# Altium project STM32F072RB_BaseBoard.PrjPcb
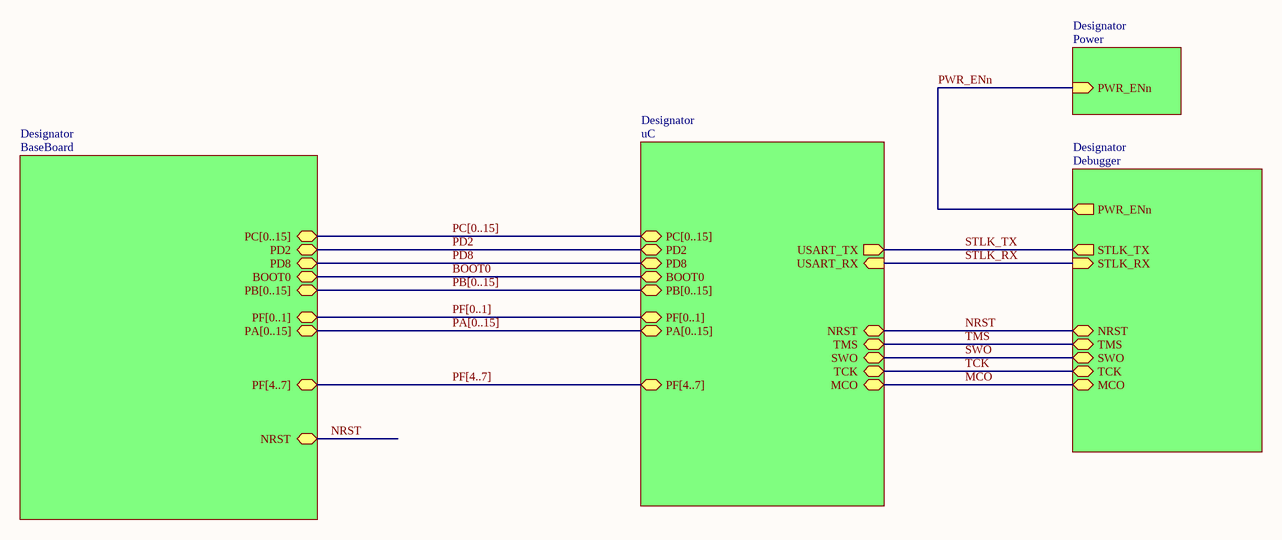
[diagram p0: TOP.SchDoc]
5 sheets, 112 parts. Net scope: hierarchical (ports join the sheet entries above them; power ports are global).
Sheets:
  TOP.SchDoc
    Designator = Debugger.SchDoc
    Designator = uC.SchDoc
    Designator = BaseBoard.SchDoc
    Designator = Power.SchDoc

## Sheet TOP.SchDoc
size A4; DocumentNumber: 1; SheetNumber: 1

### Sub-sheets
Designator = Debugger: MCO, STLK_TX (out), STLK_RX (in), NRST, TMS, SWO, TCK, PWR_ENn (out)
Designator = uC: PC[0..15] (bidir), NRST, PD2, PD8, BOOT0, PB[0..15] (bidir), USART_RX (in), PF[0..1] (bidir), PA[0..15] (bidir), USART_TX (out), TCK, TMS, PF[4..7] (bidir), SWO, MCO
Designator = BaseBoard: PD8, BOOT0, PC[0..15] (bidir), PB[0..15] (bidir), NRST, PF[0..1] (bidir), PF[4..7] (bidir), PD2, PA[0..15] (bidir)
Designator = Power: PWR_ENn (in)

### Nets
STLK_RX: sheet Designator/STLK_RX, sheet Designator/USART_RX  [project net PA3]
BOOT0: sheet Designator/BOOT0, sheet Designator/BOOT0
MCO: sheet Designator/MCO, sheet Designator/MCO
NRST: sheet Designator/NRST, sheet Designator/NRST, sheet Designator/NRST
PD2: sheet Designator/PD2, sheet Designator/PD2
PD8: sheet Designator/PD8, sheet Designator/PD8
PWR_ENn: sheet Designator/PWR_ENn, sheet Designator/PWR_ENn
STLK_TX: sheet Designator/STLK_TX, sheet Designator/USART_TX  [project net PA2]
SWO: sheet Designator/SWO, sheet Designator/SWO  [project net PB3]
TCK: sheet Designator/TCK, sheet Designator/TCK  [project net PA14]
TMS: sheet Designator/TMS, sheet Designator/TMS  [project net PA13]

### Buses and harness runs
bus PA[0..15] = sheet Designator/PA[0..15]
bus PB[0..15] = sheet Designator/PB[0..15]
bus PC[0..15] = sheet Designator/PC[0..15]
bus PF[0..1] = sheet Designator/PF[0..1]
bus PF[4..7] = sheet Designator/PF[4..7]

## Sheet Debugger.SchDoc
size A3; DocumentNumber: 2; SheetNumber: 2
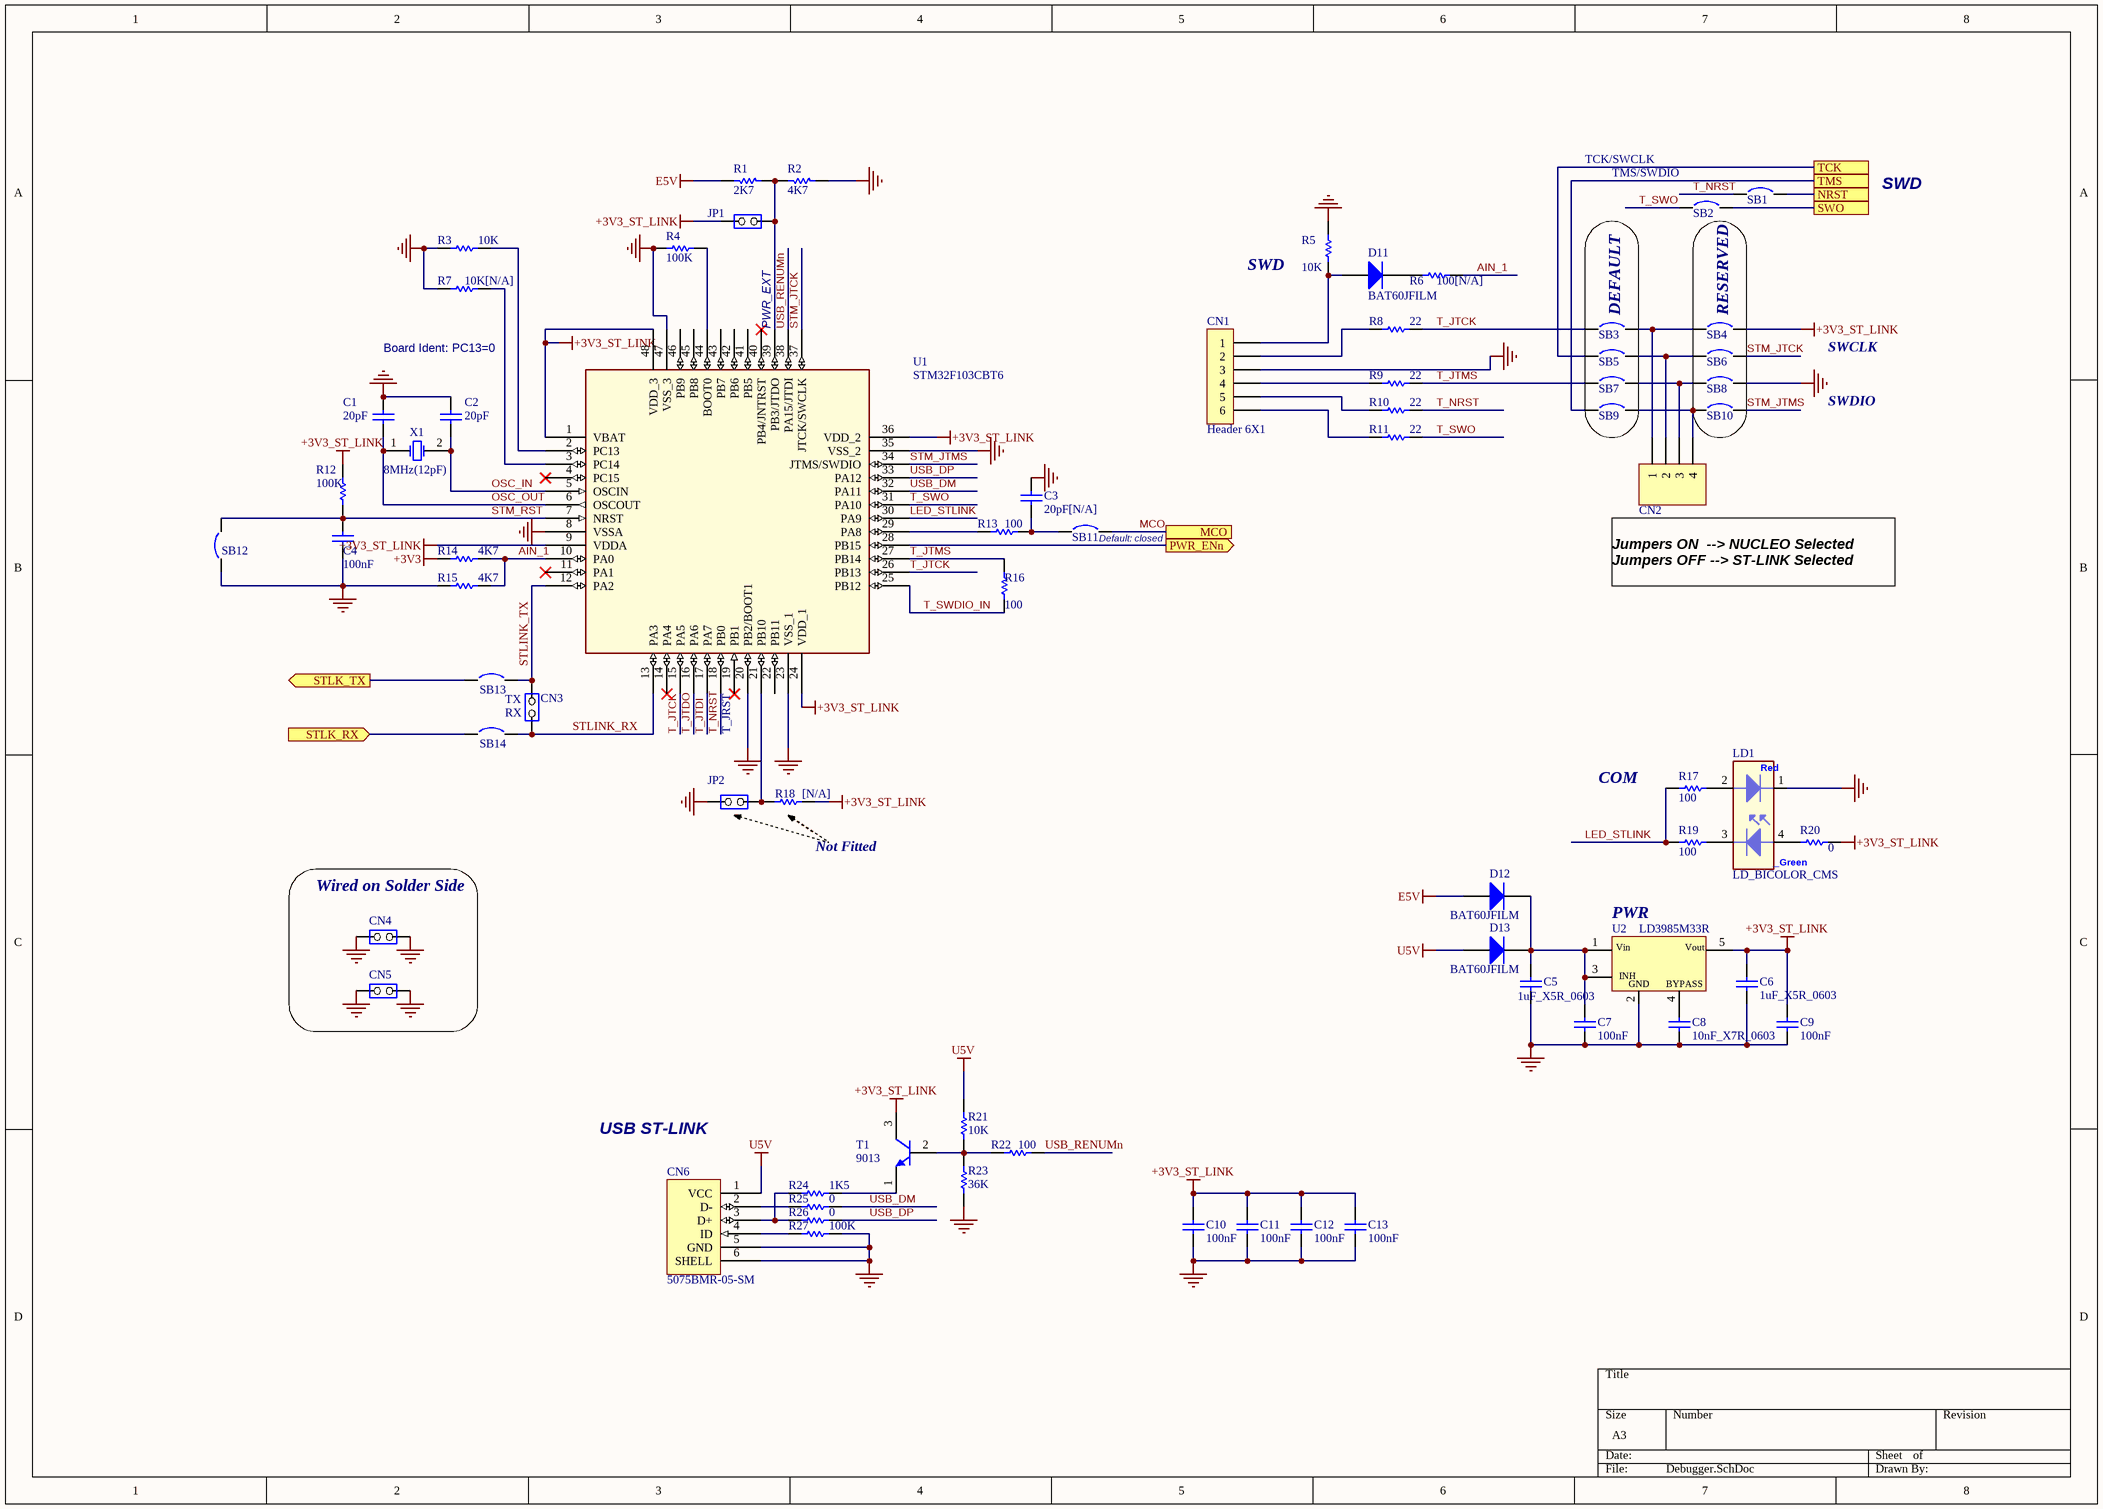
[diagram p1: Debugger.SchDoc]

### Parts
C1  20pF  [0603C]
C2  20pF  [0603C]
C3  20pF[N/A]  [0603C]
C4  100nF  [0603C]
C5  1uF_X5R_0603  [0603C]
C6  1uF_X5R_0603  [0603C]
C7  100nF  [0603C]
C8  10nF_X7R_0603  [0603C]
C9  100nF  [0603C]
C10  100nF  [0603C]
C11  100nF  [0603C]
C12  100nF  [0603C]
C13  100nF  [0603C]
CN1  Header 6X1  [1*6P]
CN2  Header 4  [1*4]  (value not drawn)
CN3  (no value)  [SIP2/2.54]
CN4  (no value)  [SIP2/2.54]
CN5  (no value)  [SIP2/2.54]
CN6  5075BMR-05-SM  [USB-MINI-B-SMD]
D11  BAT60JFILM  [SOD323/A]
D12  BAT60JFILM  [SOD323/A]
D13  BAT60JFILM  [SOD323/A]
JP1  (no value)  [SIP2/2.54]
JP2  (no value)  [SIP2/2.54]
LD1  LD_BICOLOR_CMS  [HSMF-A201]
R1  2K7  [0603R]
R2  4K7  [0603R]
R3  10K  [0603R]
R4  100K  [0603R]
R5  10K  [0603R]
R6  100[N/A]  [0603R]
R7  10K[N/A]  [0603R]
R8  22  [0603R]
R9  22  [0603R]
R10  22  [0603R]
R11  22  [0603R]
R12  100K  [0603R]
R13  100  [0603R]
R14  4K7  [0603R]
R15  4K7  [0603R]
R16  100  [0603R]
R17  100  [0603R]
R18  [N/A]  [0603R]
R19  100  [0603R]
R20  0  [0603R]
R21  10K  [0603R]
R22  100  [0603R]
R23  36K  [0603R]
R24  1K5  [0603R]
R25  0  [0603R]
R26  0  [0603R]
R27  100K  [0603R]
SB1  Circuit Breaker  [JP2_SMD]  (value not drawn)
SB2  Circuit Breaker  [JP2_SMD]  (value not drawn)
SB3  Circuit Breaker  [JP2_SMD]  (value not drawn)
SB4  Circuit Breaker  [JP2_SMD]  (value not drawn)
SB5  Circuit Breaker  [JP2_SMD]  (value not drawn)
SB6  Circuit Breaker  [JP2_SMD]  (value not drawn)
SB7  Circuit Breaker  [JP2_SMD]  (value not drawn)
SB8  Circuit Breaker  [JP2_SMD]  (value not drawn)
SB9  Circuit Breaker  [JP2_SMD]  (value not drawn)
SB10  Circuit Breaker  [JP2_SMD]  (value not drawn)
SB11  Circuit Breaker  [JP2_SMD]  (value not drawn)
SB12  Circuit Breaker  [JP2_SMD]  (value not drawn)
SB13  Circuit Breaker  [JP2_SMD]  (value not drawn)
SB14  Circuit Breaker  [JP2_SMD]  (value not drawn)
T1  9013  [SOT-23]
U1  STM32F103CBT6  [QFP48 7X7]
U2  LD3985M33R  [SOT-23-5L]
X1  8MHz(12pF)  [XTAL1]

### Blocks framed on the sheet
DEFAULT: SB3 SB5 SB7 SB9
RESERVED: SB4 SB6 SB8 SB10
Wired on Solder Side: CN4 CN5

### Ports
MCO, NRST, PWR_ENn (out), STLK_RX (in), STLK_TX (out), SWO, TCK, TMS

### Nets
+3V3: R14.1
+3V3_ST_LINK: C6.1 C9.2 C10.2 C11.2 C12.2 C13.2 JP1.1(COMMON) R12.2 R18.1 R20.2 SB4.2 T1.3(C) U1.1(VBAT) U1.9(VDDA) U1.24(VDD_1) U1.36(VDD_2) U1.48(VDD_3) U2.5(Vout)
E5V: D12.1(A) R1.1
GND: C1.2 C2.2 C3.2 C4.1 C5.1 C6.2 C7.1 C8.1 C9.1 C10.1 C11.1 C12.1 C13.1 CN1.3 CN4.1(COMMON) CN4.2(NO) CN5.1(COMMON) CN5.2(NO) CN6.5(GND) CN6.6(SHELL) JP2.1(COMMON) LD1.1 R2.2 R3.1 R4.1 R5.2 R7.1 R15.1 R23.1 R27.2 SB8.2 SB12.1 U1.8(VSSA) U1.20(PB2/BOOT1) U1.23(VSS_1) U1.35(VSS_2) U1.47(VSS_3) U2.2(GND)
PA3: SB14.1 ; port STLK_RX
U5V: CN6.1(VCC) D13.1(A) R21.2
AIN_1: R6.2 R14.2 R15.2 U1.10(PA0)
LED_STLINK: R17.1 R19.1 U1.30(PA9)
MCO: SB11.2 ; port MCO
NRST: SB1.2 ; port NRST
OSC_IN: C2.1 U1.5(OSCIN) X1.2(OSC2)
OSC_OUT: C1.1 U1.6(OSCOUT) X1.1(OSC1)
PA2: SB13.1 ; port STLK_TX
PA13: SB9.1 ; port TMS
PA14: SB5.1 ; port TCK
PB3: SB2.2 ; port SWO
PWR_ENn: U1.28(PB15) ; port PWR_ENn
STLINK_RX: CN3.1(COMMON) SB14.2 U1.13(PA3)
STLINK_TX: CN3.2(NO) SB13.2 U1.12(PA2)
STM_JTCK: SB6.2 U1.37(JTCK/SWCLK)
STM_JTMS: SB10.2 U1.34(JTMS/SWDIO)
STM_RST: C4.2 R12.1 SB12.2 U1.7(NRST)
T_JTCK: R8.2 SB3.1 U1.15(PA5) U1.26(PB13)
T_JTDI: U1.17(PA7)
T_JTDO: U1.16(PA6)
T_JTMS: R9.2 R16.2 SB7.1 U1.27(PB14)
T_NRST: R10.2 SB1.1 U1.18(PB0)
T_SWDIO_IN: R16.1 U1.25(PB12)
T_SWO: R11.2 SB2.1 U1.31(PA10)
USB_DM: R25.2 U1.32(PA11)
USB_DP: R26.2 U1.33(PA12)
USB_RENUMn: R22.2 U1.38(PA15/JTDI)
NetC3_1: C3.1 R13.2 SB11.1
NetC5_2: C5.2 C7.2 D12.2(K) D13.2(K) U2.1(Vin) U2.3(CE)
NetC8_2: C8.2 U2.4(BYPASS)
NetCN1_1: CN1.1 D11.1(A) R5.1
NetCN1_2: CN1.2 R8.1
NetCN1_4: CN1.4 R9.1
NetCN1_5: CN1.5 R10.1
NetCN1_6: CN1.6 R11.1
NetCN2_1: CN2.1 SB3.2 SB4.1
NetCN2_2: CN2.2 SB5.2 SB6.1
NetCN2_3: CN2.3 SB7.2 SB8.1
NetCN2_4: CN2.4 SB9.2 SB10.1
NetCN6_2: CN6.2(D-) R25.1
NetCN6_3: CN6.3(D+) R24.1 R26.1
NetCN6_4: CN6.4(ID) R27.1
NetD11_2: D11.2(K) R6.1
NetJP1_2: JP1.2(NO) R1.2 R2.1 U1.39(PB3/JTDO)
NetJP2_2: JP2.2(NO) R18.2 U1.21(PB10)
NetLD1_2: LD1.2 R17.2
NetLD1_3: LD1.3 R19.2
NetLD1_4: LD1.4 R20.1
NetR3_2: R3.2 U1.2(PC13)
NetR4_2: R4.2 U1.44(BOOT0)
NetR7_2: R7.2 U1.3(PC14)
NetR13_1: R13.1 U1.29(PA8)
NetR21_1: R21.1 R22.1 R23.2 T1.2(B)
NetR24_2: R24.2 T1.1(E)

Not connected (* = marked no-connect by the designer): U1 4(PC15)* 11(PA1)* 14(PA4)* 19(PB1)* 22(PB11) 40(PB4/JNTRST)* 41(PB5) 42(PB6) 43(PB7) 45(PB8) 46(PB9)

### Notes on the sheet
- TCK/SWCLK
- (near SB2) TMS/SWDIO
- SWD
- Board Ident: PC13=0
- (near U1) PWR_EXT
- SWCLK
- SWDIO
- (near SB11) Default: closed
- Jumpers ON  --> NUCLEO Selected
  Jumpers OFF --> ST-LINK Selected
- TX
- RX
- T_JRST
- COM
- (near R18) Not Fitted
- (near U2) PWR
- USB ST-LINK
- (in symbol LD3985M33R) INH
- (in symbol LD_BICOLOR_CMS) Red; _Green

### Library data of the parts
C1-C3 = Capacitor_ST: Capacitor 0402 / 0603 / 0805; Value: 100nF; Revision: July-2002: Re-released for DXP Platform.
C4 C7 C9-C13 = Capacitor_ST: Capacitor 0402 / 0603 / 0805; Revision: July-2002: Re-released for DXP Platform.; Value: 100nF
C5 C6 = CAP SMD 0603  X5R 1µF 25V 10%: 0603  X5R 1µF; Rated voltage: 25V; Tolerance: 10%; Manufacturer: *; Manufacturer P/N: *; Order code Farnell: 1288202RL; Value: 1µF; Power: *; Technology: X5R; Temperature  Factor: *; Temperature Max: +125°C; Temperature Min: -55°C; STS Code: *
C8 = CAP SMD 0603  X7R 10000PF 50V 10%: 0603  X7R 10NF; Order code RS: 2040779; Rated voltage: 50V; Tolerance: 10%; Order code Farnell: 7569548RL; Value: 10NF; Power: *; Technology: X7R; Temperature Factor: *; Temperature Min: -55°C; Temperature Max: +125°C; STS Code: *
CN1 = Header 6X1: Header, 6-Pin, Single row; LatestRevisionDate: 17-Jul-2002; LatestRevisionNote: Re-released for DXP Platform.; Publisher: Altium Limited
CN2 = Header 4: Header, 4-Pin, Single row; Revision: 17-Jul-2002: Re-released for DXP Platform.; Publisher: Altium Limited
CN3 = JP2: Fitted: NO
CN4 CN5 JP1 JP2 = JP2
CN6 = USB-MINI-typeB connector: Manuf_Part_1: 5075BMR-05-SM; Order: 5075BMR-05-SM; ECCN: ????
D11-D13 = BAT60JFILM: Manuf_1: STM; Provided: ST; ECCN_US/EU: EAR99/NEC; Revision: July-2002: Re-released for DXP Platform.; Order: BAT60JFILM; Manuf_Part_1: BAT60JFILM; Distrib: ST
LD1 = LD_BICOLOR_CMS: Bicolor Led; Manuf_Part_1: HSMF-A201-A00J1; Manuf_1: Avago Technologies; Ref St: xxxxxx; cap_dec: ----; Distrib: RADIOSPARES
R1 R2 R18 R21 R23 = Res1: Resistor; Value: 1K; Published: 8-Jun-2000; Revision: July-2002: Re-released for DXP Platform.; Publisher: Altium Limited
R3 R5 = Resistor_ST: Resistor 0402 / 0603 / 0805; Value: 10K
R4 R6 R8-R13 R16 R17 R19 R20 R22 R24-R27 = Resistor_ST: Resistor 0402 / 0603 / 0805; Value: 10K
R7 R14 R15 = Resistor_ST: Resistor 0402 / 0603 / 0805; Value: 10K; Fitted: NO
SB1 SB4 SB6 SB8 SB10 = Circuit Breaker: Solder: YES; Published: 24-Mar-1999; Revision: July-2002: Re-released for DXP Platform.; Publisher: Altium Limited
SB2 SB3 SB5 SB7 SB9 SB11-SB14 = Circuit Breaker: Solder: NO; Published: 24-Mar-1999; Revision: July-2002: Re-released for DXP Platform.; Publisher: Altium Limited
T1 = NPN: NPN Bipolar Transistor; Code - JEDEC: TO-226-AA; Published: 8-Jun-2000; Revision: July-2002: Re-released for DXP Platform.; Publisher: Altium Limited
U1 = STM32F103CBT6: Medium-density performance line ARM-based 32-bit MCU with 64KB Flash; Manuf_Part_1: STM32F103C8T6; Manuf_1: STM; Ref St: 9175981; Provided: ST; ECCN_US/EU: 3A991A2/NEC; Distrib: ST; Order: STM32F103C8T6
U2 = LD3985M33R: Ultra low drop-low noise BiCMOS voltage, regulators low ESR capacitors compatible; Manuf_1: STM; Provided: ST; Ref St: 9176161; ECCN_US/EU: EAR99/NEC; Manuf_Part_1: LD3985M33R; Distrib: ST; Order: LD3985M33R
X1 = XTAL: Crystal Oscillator; Published: 8-Jun-2000; LatestRevisionDate: 17-Jul-2002; LatestRevisionNote: Re-released for DXP Platform.; PackageReference: R38; Publisher: Altium Limited

## Sheet uC.SchDoc
size A3; DocumentNumber: 3; SheetNumber: 3
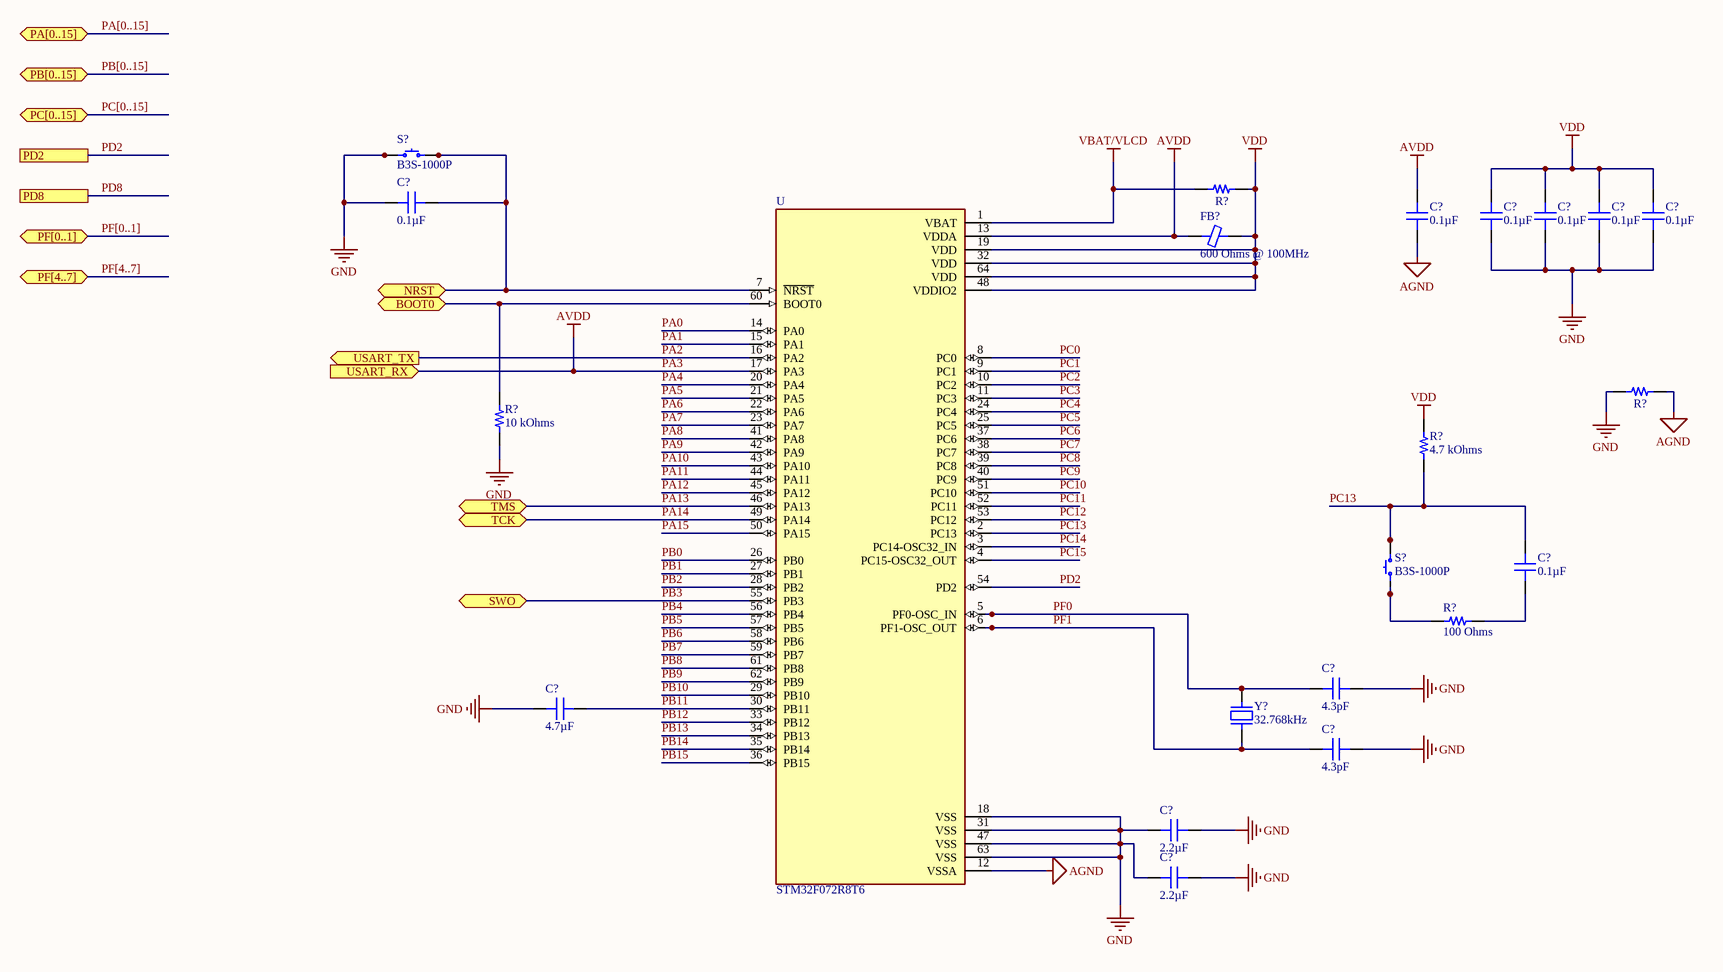
[diagram p2: uC.SchDoc]

### Parts
(Parts that share a designator on the sheet are numbered #1, #2 ... from top to bottom, then left to right.)
C?#1  0.1µF  [CAP 0805_2012]
C?#2  0.1µF  [CAP 0805_2012]
C?#3  0.1µF  [CAP 0805_2012]
C?#4  0.1µF  [CAP 0805_2012]
C?#5  0.1µF  [CAP 0805_2012]
C?#6  0.1µF  [CAP 0805_2012]
C?#7  0.1µF  [CAP 0805_2012]
C?#8  4.3pF  [CAP 0805_2012]
C?#9  4.7µF  [CAP 0805_2012]
C?#10  4.3pF  [CAP 0805_2012]
C?#11  2.2µF  [CAP 0805_2012]
C?#12  2.2µF  [CAP 0805_2012]
FB?  600 Ohms @ 100MHz  [FER 0603_1608]
R?#1  (no value)  [RES 0603_1608]
R?#2  (no value)  [RES 0603_1608]
R?#3  10 kOhms  [RES 0805_2012]
R?#4  4.7 kOhms  [RES 0805_2012]
R?#5  100 Ohms  [RES 0805_2012]
S?#1  B3S-1000P  [OMRON B3S-1000P]
S?#2  B3S-1000P  [OMRON B3S-1000P]
U  STM32F072R8T6  [QFP50P1200X1200X160-64N]
Y?  32.768kHz  [ABRACON ABS25]

### Ports
BOOT0 (bidir), NRST (bidir), PA[0..15] (bidir), PB[0..15] (bidir), PC[0..15] (bidir), PD2, PD8, PF[0..1] (bidir), PF[4..7] (bidir), SWO (bidir), TCK (bidir), TMS (bidir), USART_RX (in), USART_TX (out)

### Nets
AGND: C?#2.1 R?#2.2 U.12(VSSA)
GND: C?#1.2 C?#3.1 C?#4.1 C?#5.1 C?#6.1 C?#8.2 C?#9.1 C?#10.2 C?#11.1 C?#11.2 C?#12.1 C?#12.2 R?#2.1 R?#3.1 S?#1.1 S?#1.2 U.18(VSS) U.31(VSS) U.47(VSS) U.63(VSS)
PA3: C?#2.2 FB?.1 U.13(VDDA) U.17(PA3) ; port USART_RX  [also labelled AVDD]
VBAT/VLCD: R?#1.1 U.1(VBAT)
VDD: C?#3.2 C?#4.2 C?#5.2 C?#6.2 FB?.2 R?#1.2 R?#4.2 U.19(VDD) U.32(VDD) U.48(VDDIO2) U.64(VDD)
BOOT0: R?#3.2 U.60(BOOT0) ; port BOOT0
NRST: C?#1.1 S?#1.3 S?#1.4 U.7(~{NRST}) ; port NRST
PA0: U.14(PA0)
PA1: U.15(PA1)
PA2: U.16(PA2) ; port USART_TX
PA4: U.20(PA4)
PA5: U.21(PA5)
PA6: U.22(PA6)
PA7: U.23(PA7)
PA8: U.41(PA8)
PA9: U.42(PA9)
PA10: U.43(PA10)
PA11: U.44(PA11)
PA12: U.45(PA12)
PA13: U.46(PA13) ; port TMS
PA14: U.49(PA14) ; port TCK
PA15: U.50(PA15)
PB0: U.26(PB0)
PB1: U.27(PB1)
PB2: U.28(PB2)
PB3: U.55(PB3) ; port SWO
PB4: U.56(PB4)
PB5: U.57(PB5)
PB6: U.58(PB6)
PB7: U.59(PB7)
PB8: U.61(PB8)
PB9: U.62(PB9)
PB10: U.29(PB10)
PB11: C?#9.2 U.30(PB11)
PB12: U.33(PB12)
PB13: U.34(PB13)
PB14: U.35(PB14)
PB15: U.36(PB15)
PC0: U.8(PC0)
PC1: U.9(PC1)
PC2: U.10(PC2)
PC3: U.11(PC3)
PC4: U.24(PC4)
PC5: U.25(PC5)
PC6: U.37(PC6)
PC7: U.38(PC7)
PC8: U.39(PC8)
PC9: U.40(PC9)
PC10: U.51(PC10)
PC11: U.52(PC11)
PC12: U.53(PC12)
PC13: C?#7.2 R?#4.1 S?#2.3 S?#2.4 U.2(PC13)
PC14: U.3(PC14-OSC32_IN)
PC15: U.4(PC15-OSC32_OUT)
PD2: U.54(PD2) ; port PD2
PF0: C?#8.1 U.5(PF0-OSC_IN) Y?.4
PF1: C?#10.1 U.6(PF1-OSC_OUT) Y?.1
NetC?#7_1: C?#7.1 R?#5.2
NetR?#5_1: R?#5.1 S?#2.1 S?#2.2

### Buses and harness runs
bus PA[0..15] = port PA[0..15]
bus PB[0..15] = port PB[0..15]
bus PC[0..15] = port PC[0..15]
bus PF[0..1] = port PF[0..1]
bus PF[4..7] = port PF[4..7]

### Library data of the parts
C?#1-C?#7 = AC0805KKX8R9BB104: CAP CER 0805 10% X8R 50V 100NF; Manufacturer: Yageo; Part Number: AC0805KKX8R9BB104; Value: 0.1µF; Applications: Automotive; Capacitance: 0.1µF; ComponentLink1Description: Datasheet; ComponentLink1URL: http://www.yageo.com/documents/recent/AC0805KKX8R9BB104.pdf; ComponentLink2Description: DigiKey Link; ComponentLink2URL: http://digikey.com/product-detail/en/yageo/AC0805KKX8R9BB104/311-4624-1-ND/9699550; Device Package: 0805 (2012 Metric); LastUpdated: 02/09/2020 01:04:20; Lifecycle Status: Active; Minimum Order: 1; Mounting Type: Surface Mount, MLCC; Operating Temperature: -55°C ~ 150°C; Package / Case: 0805 (2012 Metric); Packaging: TapeAndReel; PartId: 14076; Part Status: Active; Price: 0.06; Ratings: AEC-Q200; Series: AC; Size / Dimension: 0.079" L x 0.049" W (2.00mm x 1.25mm); Supplier 1: DigiKey; Supplier Part Number 1: 311-4624-1-ND; Temperature Coefficient: X8R; Thickness (Max): 0.057" (1.45mm); Tolerance: ±10%; Voltage - Rated: 50V
C?#8 C?#10 = 08051A4R3CAT2A: CAP CER 4.3PF 100V NP0 0805; Manufacturer: AVX Corporation; Temperature Coefficient: C0G, NP0; Tolerance: ±0.25pF; Part Number: 08051A4R3CAT2A; Value: 4.3pF; Applications: General Purpose; Capacitance: 4.3pF; ComponentLink1Description: Datasheet; ComponentLink1URL: http://datasheets.avx.com/C0GNP0-Dielectric.pdf; ComponentLink2Description: DigiKey Link; ComponentLink2URL: http://digikey.com/product-detail/en/avx-corporation/08051A4R3CAT2A/478-10404-1-ND/6797329; Device Package: 0805 (2012 Metric); LastUpdated: 02/09/2020 01:04:08; Lifecycle Status: Active; Minimum Order: 1; Mounting Type: Surface Mount, MLCC; Operating Temperature: -55°C ~ 125°C; Package / Case: 0805 (2012 Metric); Packaging: TapeAndReel; PartId: 17882; Part Status: Active; Price: 0.04; Series: -; Size / Dimension: 0.079" L x 0.049" W (2.01mm x 1.25mm); Supplier 1: DigiKey; Supplier Part Number 1: 478-10404-1-ND; Thickness (Max): 0.037" (0.94mm); Voltage - Rated: 100V
C?#9 = TMK212BBJ475KGHT: CAP CER 4.7UF 25V X5R 0805; Manufacturer: Taiyo Yuden; Tolerance: ±10%; Part Number: TMK212BBJ475KGHT; Value: 4.7µF; Applications: Automotive; Capacitance: 4.7µF; ComponentLink1Description: Datasheet; ComponentLink1URL: https://www.yuden.co.jp/productdata/catalog/mlcc_all_hq_e.pdf; ComponentLink2Description: DigiKey Link; ComponentLink2URL: http://digikey.com/product-detail/en/taiyo-yuden/TMK212BBJ475KGHT/587-3713-1-ND/4811183; Device Package: 0805 (2012 Metric); LastUpdated: 02/09/2020 01:04:32; Lifecycle Status: Active; Minimum Order: 1; Mounting Type: Surface Mount, MLCC; Operating Temperature: -55°C ~ 85°C; Package / Case: 0805 (2012 Metric); Packaging: TapeAndReel; PartId: 8142; Part Status: Active; Price: 0.07; Ratings: AEC-Q200; Series: M; Size / Dimension: 0.079" L x 0.049" W (2.00mm x 1.25mm); Supplier 1: DigiKey; Supplier Part Number 1: 587-3713-1-ND; Temperature Coefficient: X5R; Thickness (Max): 0.057" (1.45mm); Voltage - Rated: 25V
C?#11 C?#12 = CL21F225ZOFNNNE: CAP CER 2.2UF 16V Y5V 0805; Manufacturer: Samsung Electro-Mechanics; Temperature Coefficient: Y5V (F); Tolerance: -20%, +80%; Part Number: CL21F225ZOFNNNE; Value: 2.2µF; Applications: General Purpose; Capacitance: 2.2µF; ComponentLink1Description: Datasheet; ComponentLink1URL: http://www.samsungsem.com/kr/support/product-search/mlcc/CL21F225ZOFNNNE.jsp; ComponentLink2Description: DigiKey Link; ComponentLink2URL: http://digikey.com/product-detail/en/samsung-electro-mechanics/CL21F225ZOFNNNE/1276-3016-1-ND/3891102; Device Package: 0805 (2012 Metric); LastUpdated: 02/09/2020 01:04:16; Lifecycle Status: Active; Minimum Order: 1; Mounting Type: Surface Mount, MLCC; Operating Temperature: -30°C ~ 85°C; Package / Case: 0805 (2012 Metric); Packaging: TapeAndReel; PartId: 15359; Part Status: Active; Price: 0.03; Series: CL; Size / Dimension: 0.079" L x 0.049" W (2.00mm x 1.25mm); Supplier 1: DigiKey; Supplier Part Number 1: 1276-3016-1-ND; Thickness (Max): 0.053" (1.35mm); Voltage - Rated: 16V
FB? = BLM18DN601SZ1D: FERRITEBEAD SMD Z100MHZ=600OHM 7; Manufacturer: Murata Electronics; Current Rating (Max): 700mA; Number of Lines: 1; Part Number: BLM18DN601SZ1D; ComponentLink1Description: Datasheet; ComponentLink1URL: https://www.murata.com/en-us/api/pdfdownloadapi?cate=luNoiseSupprFilteChipFerriBead&partno=BLM18DN601SZ1%23; ComponentLink2Description: DigiKey Link; ComponentLink2URL: http://digikey.com/product-detail/en/murata-electronics/BLM18DN601SZ1D/490-18575-1-ND/10135586; Device Package: 0603 (1608 Metric); Height (Max): 0.037" (0.95mm); Impedance @ Frequency: 600 Ohms @ 100MHz; LastUpdated: 02/09/2020 01:18:18; Lifecycle Status: Active; Minimum Order: 1; Mounting Type: Surface Mount; Operating Temperature: -55°C ~ 125°C; Package / Case: 0603 (1608 Metric); Packaging: TapeAndReel; PartId: 783; Part Status: Active; Price: 0.05; Ratings: AEC-Q200; Series: EMIFIL®, BLM18; Size / Dimension: 0.063" L x 0.031" W (1.60mm x 0.80mm); Supplier 1: DigiKey; Supplier Part Number 1: 490-18575-1-ND; Value: 600 Ohms @ 100MHz
R?#1 R?#2 = RCA06030000ZSEA: RES SMD 0 OHM JUMPER 1/10W 0603; Manufacturer: Vishay Dale; Power (Watts): 0.1W, 1/10W; Part Number: RCA06030000ZSEA; ComponentLink1Description: Datasheet; ComponentLink1URL: http://www.vishay.com/docs/20037/rcae3.pdf; ComponentLink2Description: DigiKey Link; ComponentLink2URL: http://digikey.com/product-detail/en/vishay-dale/RCA06030000ZSEA/541-2192-1-ND/4946845; Composition: Thick Film; Device Package: 0603 (1608 Metric); Features: Anti-Sulfur, Automotive AEC-Q200; Height - Seated (Max): 0.020" (0.50mm); LastUpdated: 02/09/2020 01:10:23; Lifecycle Status: Active; Minimum Order: 1; Number of Terminations: 2; Operating Temperature: -55°C ~ 155°C; Package / Case: 0603 (1608 Metric); Packaging: TapeAndReel; PartId: 5740; Part Status: Active; Price: 0.01; Ratings: AEC-Q200; Series: RCA; Size / Dimension: 0.061" L x 0.033" W (1.55mm x 0.85mm); Supplier 1: DigiKey; Supplier Part Number 1: 541-2192-1-ND; Supplier Device Package: 0603; Tolerance: Jumper
R?#3 = CPF0805B10KE: RES SMD 10K OHM 0.1% 1/10W 0805; Manufacturer: TE Connectivity Passive Product; Power (Watts): 0.1W, 1/10W; Temperature Coefficient: ±25ppm/°C; Part Number: CPF0805B10KE; Value: 10 kOhms; ComponentLink1Description: Datasheet; ComponentLink1URL: https://www.te.com/commerce/DocumentDelivery/DDEController?Action=srchrtrv&DocNm=1773200&DocType=DS&DocLang=English; ComponentLink2Description: DigiKey Link; ComponentLink2URL: http://digikey.com/product-detail/en/te-connectivity-passive-product/CPF0805B10KE/A106043CT-ND/3477679; Composition: Thin Film; Device Package: 0805 (2012 Metric); Height - Seated (Max): 0.026" (0.65mm); LastUpdated: 02/09/2020 01:15:24; Lifecycle Status: Active; Minimum Order: 1; Number of Terminations: 2; Operating Temperature: -55°C ~ 155°C; Package / Case: 0805 (2012 Metric); Packaging: TapeAndReel; PartId: 27724; Part Status: Active; Price: 0.09; Resistance: 10 kOhms; Series: CPF, Neohm; Size / Dimension: 0.079" L x 0.049" W (2.00mm x 1.25mm); Supplier 1: DigiKey; Supplier Part Number 1: A106043CT-ND; Supplier Device Package: 0805; Tolerance: ±0.1%
R?#4 = CRCW08054K70JNTA: RES SMD 4.7K OHM 5% 1/8W 0805; Manufacturer: Vishay Dale; Power (Watts): 0.125W, 1/8W; Temperature Coefficient: ±200ppm/°C; Part Number: CRCW08054K70JNTA; Value: 4.7 kOhms; ComponentLink1Description: Datasheet; ComponentLink1URL: http://www.vishay.com/docs/20008/dcrcw.pdf; ComponentLink2Description: DigiKey Link; ComponentLink2URL: http://digikey.com/product-detail/en/vishay-dale/CRCW08054K70JNTA/541-3029-1-ND/6073672; Composition: Thick Film; Device Package: 0805 (2012 Metric); Features: Automotive AEC-Q200; Height - Seated (Max): 0.020" (0.50mm); LastUpdated: 02/09/2020 01:15:17; Lifecycle Status: Active; Minimum Order: 1; Number of Terminations: 2; Operating Temperature: -55°C ~ 155°C; Package / Case: 0805 (2012 Metric); Packaging: TapeAndReel; PartId: 30842; Part Status: Active; Price: 0.01; Ratings: AEC-Q200; Resistance: 4.7 kOhms; Series: CRCW; Size / Dimension: 0.079" L x 0.049" W (2.00mm x 1.25mm); Supplier 1: DigiKey; Supplier Part Number 1: 541-3029-1-ND; Supplier Device Package: 0805; Tolerance: ±5%
R?#5 = CRCW0805100RFKEB: RES SMD 100 OHM 1% 1/8W 0805; Manufacturer: Vishay Dale; Power (Watts): 0.125W, 1/8W; Temperature Coefficient: ±100ppm/°C; Part Number: CRCW0805100RFKEB; Value: 100 Ohms; ComponentLink1Description: Datasheet; ComponentLink1URL: http://www.vishay.com/docs/20035/dcrcwe3.pdf; ComponentLink2Description: DigiKey Link; ComponentLink2URL: http://digikey.com/product-detail/en/vishay-dale/CRCW0805100RFKEB/541-CRCW0805100RFKEBCT-ND/11501183; Composition: Thick Film; Device Package: 0805 (2012 Metric); Features: Automotive AEC-Q200; LastUpdated: 02/09/2020 01:14:22; Lifecycle Status: Active; Minimum Order: 1; Number of Terminations: 2; Operating Temperature: -55°C ~ 155°C; Package / Case: 0805 (2012 Metric); Packaging: TapeAndReel; PartId: 57124; Price: 0.01; Ratings: AEC-Q200; Resistance: 100 Ohms; Series: CRCW; Supplier 1: DigiKey; Supplier Part Number 1: 541-CRCW0805100RFKEBCT-ND; Supplier Device Package: 0805; Tolerance: ±1%
S?#1 S?#2 = B3S-1000P: SWITCH TACTILE SPST-NO 0.05A 24V; Manufacturer: Omron Electronics Inc-EMC Div; Actuator Height off PCB, Vertical: 4.30mm; Actuator Orientation: Top Actuated; Actuator Type: Standard; Contact Rating @ Voltage: 0.05A @ 24VDC; Illumination: Non-Illuminated; Ingress Protection: IP67 - Dust Tight, Waterproof; Operating Force: 160gf; Outline: 6.60mm x 6.00mm; Switch Function: Off-Mom; Part Number: B3S-1000P; Circuit: SPST-NO; ComponentLink1Description: Datasheet; ComponentLink1URL: https://omronfs.omron.com/en_US/ecb/products/pdf/en-b3s.pdf; ComponentLink2Description: DigiKey Link; ComponentLink2URL: http://digikey.com/product-detail/en/omron-electronics-inc-emc-div/B3S-1000P/SW836CT-ND/700012; Features: Sealed - Fully; LastUpdated: 09/04/2020 09:57:13; Lifecycle Status: Active; Minimum Order: 1; Mounting Type: Surface Mount; Operating Temperature: -25°C ~ 70°C; Packaging: TapeAndReel; Part Status: Active; Price: 0.39; Series: B3S; Supplier 1: DigiKey; Supplier Part Number 1: SW836CT-ND; Termination Style: Gull Wing
U = STM32F072R8T6: ARMÂ® CortexÂ®-M0 STM32F0 Microcontroller IC 32-Bit 48MHz 64KB _64K x 8_ FLASH 64-LQFP _10x10_; MF: STMicroelectronics; Value: *; Price: None; Package: LQFP-64 STMicroelectronics; SnapEDA_Link: https://www.snapeda.com/parts/STM32F072R8T6/STMicroelectronics/view-part/226402/?ref=snap; Availability: Unavailable; MP: STM32F072R8T6
Y? = ABS25-32.768KHZ-6-T: CRYSTAL 32.7680KHZ 6PF SMD; Manufacturer: Abracon LLC; ESR (Equivalent Series Resistance): 50 kOhms; Frequency Tolerance: ±20ppm; Operating Mode: Fundamental; Part Number: ABS25-32.768KHZ-6-T; ComponentLink1Description: Datasheet; ComponentLink1URL: https://abracon.com/Resonators/abs25.pdf; ComponentLink2Description: DigiKey Link; ComponentLink2URL: http://digikey.com/product-detail/en/abracon-llc/ABS25-32.768KHZ-6-T/535-10240-1-ND/2218053; Frequency: 32.768kHz; Height - Seated (Max): 0.098" (2.50mm); LastUpdated: 02/09/2020 01:21:47; Lifecycle Status: Active; Load Capacitance: 6pF; Minimum Order: 1; Mounting Type: Surface Mount; Operating Temperature: -40°C ~ 85°C; Package / Case: 4-SOJ, 5.50mm pitch; Packaging: TapeAndReel; PartId: 395; Part Status: Active; Price: 0.42; Series: ABS25; Size / Dimension: 0.315" L x 0.150" W (8.00mm x 3.80mm); Supplier 1: DigiKey; Supplier Part Number 1: 535-10240-1-ND; Type: kHz Crystal (Tuning Fork); Value: 32.768kHz

## Sheet BaseBoard.SchDoc
size A3; DocumentNumber: 5; SheetNumber: 5
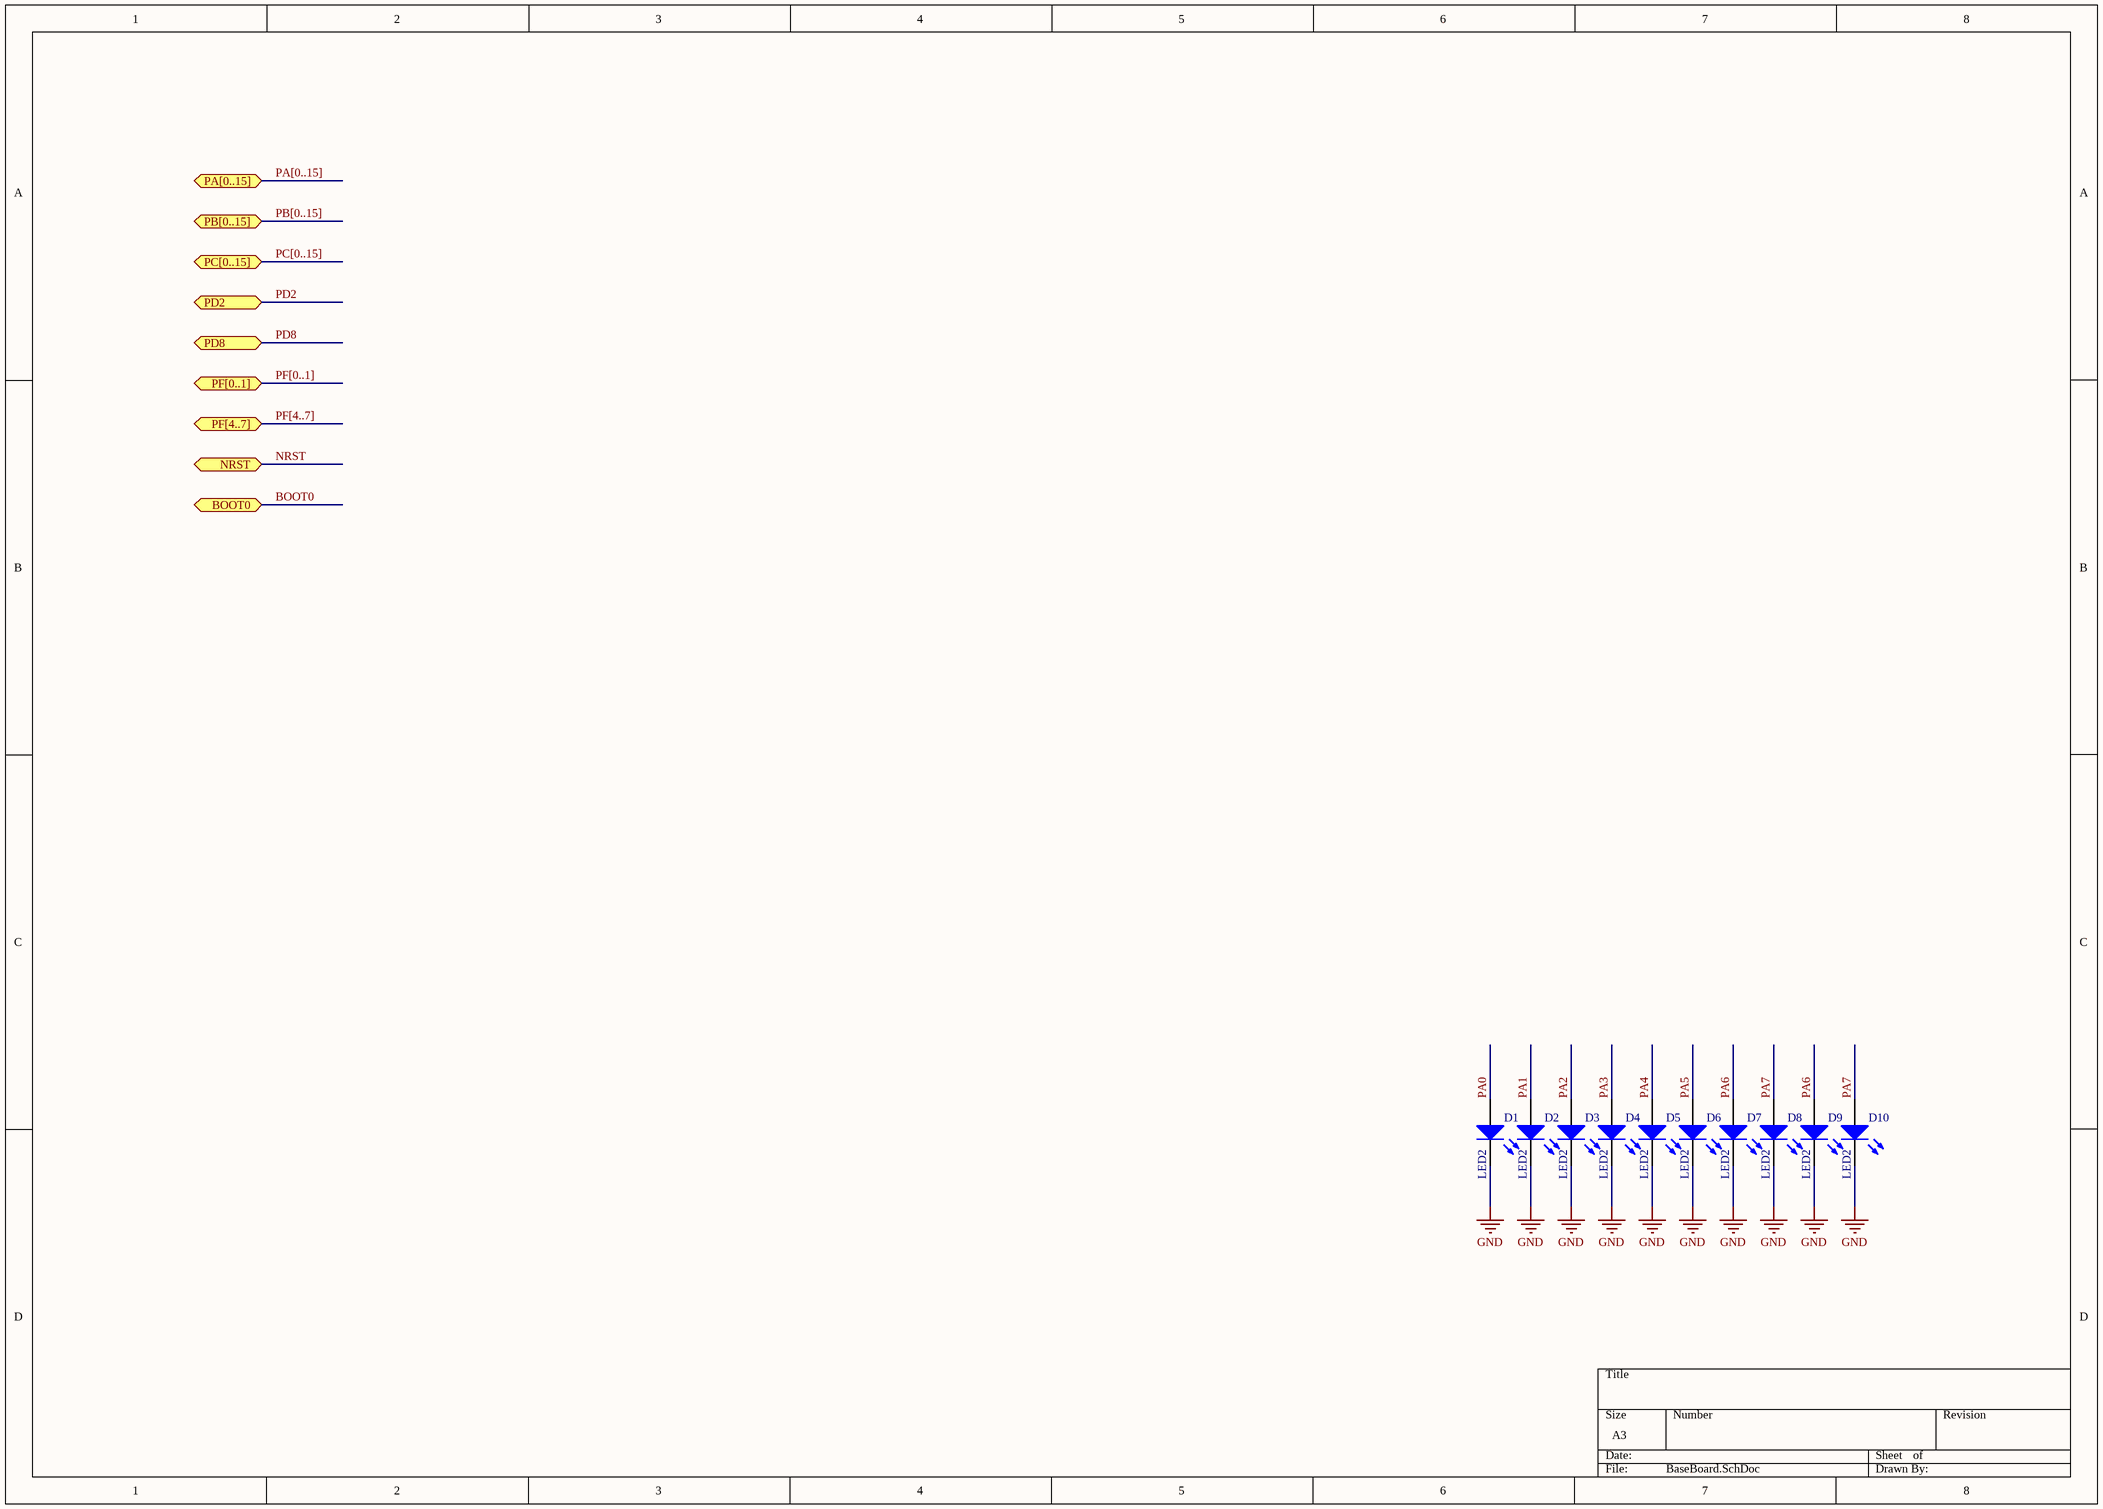
[diagram p3: BaseBoard.SchDoc]

### Parts
D1  LED2  [3.2X1.6X1.1]
D2  LED2  [3.2X1.6X1.1]
D3  LED2  [3.2X1.6X1.1]
D4  LED2  [3.2X1.6X1.1]
D5  LED2  [3.2X1.6X1.1]
D6  LED2  [3.2X1.6X1.1]
D7  LED2  [3.2X1.6X1.1]
D8  LED2  [3.2X1.6X1.1]
D9  LED2  [3.2X1.6X1.1]
D10  LED2  [3.2X1.6X1.1]

### Ports
BOOT0, NRST, PA[0..15] (bidir), PB[0..15] (bidir), PC[0..15] (bidir), PD2, PD8, PF[0..1] (bidir), PF[4..7] (bidir)

### Nets
GND: D1.2(K) D2.2(K) D3.2(K) D4.2(K) D5.2(K) D6.2(K) D7.2(K) D8.2(K) D9.2(K) D10.2(K)
PA3: D4.1(A)
PA0: D1.1(A)
PA1: D2.1(A)
PA2: D3.1(A)
PA4: D5.1(A)
PA5: D6.1(A)
PA6: D7.1(A) D9.1(A)
PA7: D8.1(A) D10.1(A)

### Buses and harness runs
bus PA[0..15] = port PA[0..15]
bus PB[0..15] = port PB[0..15]
bus PC[0..15] = port PC[0..15]
bus PF[0..1] = port PF[0..1]
bus PF[4..7] = port PF[4..7]

### Library data of the parts
D1-D10 = LED2: Typical RED, GREEN, YELLOW, AMBER GaAs LED; Published: 8-Jun-2000; LatestRevisionDate: 17-Jul-2002; LatestRevisionNote: Re-released for DXP Platform.; PackageVersion: Feb-2002; PackageReference: 3.2X1.6X1.1; Publisher: Altium Limited; PackageDescription: SM LED; 2 Flat Leads

## Sheet Power.SchDoc
size A3; DocumentNumber: 4; SheetNumber: 4
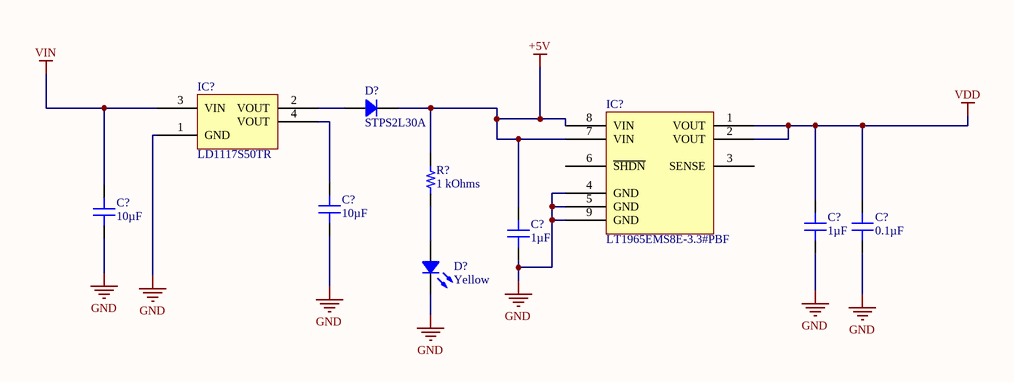
[diagram p4: Power.SchDoc]

### Parts
(Parts that share a designator on the sheet are numbered #1, #2 ... from top to bottom, then left to right.)
C?#13  10µF  [CAP 0603_1608]
C?#14  10µF  [CAP 0603_1608]
C?#15  1µF  [CAP 0603_1608]
C?#16  0.1µF  [CAP 0805_2012]
C?#17  1µF  [CAP 0603_1608]
D?#1  STPS2L30A  [DO214AC SMA]
D?#2  Yellow  [LED 1206_3216 YELLOW]
IC?#1  LD1117S50TR  [ST SOT-223]
IC?#2  LT1965EMS8E-3.3#PBF  [LT MSOP-8 MS8E 3X3MM]
R?#6  1 kOhms  [RES 0603_1608]

### Nets
+5V: C?#17.1 D?#1.2 IC?#2.7(VIN) IC?#2.8(VIN) R?#6.2
GND: C?#13.1 C?#14.1 C?#15.2 C?#16.2 C?#17.2 D?#2.2 IC?#1.1(GND) IC?#2.4(GND) IC?#2.5(GND) IC?#2.9(GND)
VDD: C?#15.1 C?#16.1 IC?#2.1(VOUT) IC?#2.2(VOUT)
VIN: C?#14.2 IC?#1.3(VIN)
NetC?#13_2: C?#13.2 IC?#1.4(VOUT)
NetD?#1_1: D?#1.1 IC?#1.2(VOUT)
NetD?#2_1: D?#2.1 R?#6.1

Not connected (* = marked no-connect by the designer): IC?#2 3(SENSE) 6(~{SHDN})

### Library data of the parts
C?#13 C?#14 = GRM188R61E106MA73D: CAP CER 10UF 25V X5R 0603; Manufacturer: Murata Electronics; Tolerance: ±20%; Part Number: GRM188R61E106MA73D; Value: 10µF; Applications: General Purpose; Capacitance: 10µF; ComponentLink1Description: Datasheet; ComponentLink1URL: https://www.murata.com/~/media/webrenewal/support/library/catalog/products/capacitor/mlcc/c02e.ashx?la=en-us; ComponentLink2Description: DigiKey Link; ComponentLink2URL: http://digikey.com/product-detail/en/murata-electronics/GRM188R61E106MA73D/490-7202-1-ND/3900486; Device Package: 0603 (1608 Metric); LastUpdated: 02/09/2020 01:03:25; Lifecycle Status: Active; Minimum Order: 1; Mounting Type: Surface Mount, MLCC; Operating Temperature: -55°C ~ 85°C; Package / Case: 0603 (1608 Metric); Packaging: TapeAndReel; PartId: 8314; Part Status: Active; Price: 0.09; Series: GRM; Size / Dimension: 0.063" L x 0.031" W (1.60mm x 0.80mm); Supplier 1: DigiKey; Supplier Part Number 1: 490-7202-1-ND; Temperature Coefficient: X5R; Thickness (Max): 0.031" (0.80mm); Voltage - Rated: 25V
C?#15 C?#17 = C0603C105K8PACTU: CAP CER 1UF 10V X5R 0603; Manufacturer: KEMET; Tolerance: ±10%; Part Number: C0603C105K8PACTU; Value: 1µF; Applications: General Purpose; Capacitance: 1µF; ComponentLink1Description: Datasheet; ComponentLink1URL: https://api.kemet.com/component-edge/download/datasheet/C0603C105K8PACTU.pdf; ComponentLink2Description: DigiKey Link; ComponentLink2URL: http://digikey.com/product-detail/en/kemet/C0603C105K8PACTU/399-3118-1-ND/551623; Device Package: 0603 (1608 Metric); LastUpdated: 02/09/2020 01:03:23; Lifecycle Status: Active; Minimum Order: 1; Mounting Type: Surface Mount, MLCC; Operating Temperature: -55°C ~ 85°C; Package / Case: 0603 (1608 Metric); Packaging: TapeAndReel; PartId: 9480; Part Status: Active; Price: 0.01; Series: SMD Comm X5R; Size / Dimension: 0.063" L x 0.031" W (1.60mm x 0.80mm); Supplier 1: DigiKey; Supplier Part Number 1: 399-3118-1-ND; Temperature Coefficient: X5R; Thickness (Max): 0.035" (0.90mm); Voltage - Rated: 10V
C?#16 = AC0805KKX8R9BB104: as C?#1 on sheet uC; Part Number: AC0805KKX8R9BB104; Value: 0.1µF; Applications: Automotive; Capacitance: 0.1µF; ComponentLink1Description: Datasheet; ComponentLink1URL: http://www.yageo.com/documents/recent/AC0805KKX8R9BB104.pdf; ComponentLink2Description: DigiKey Link; ComponentLink2URL: http://digikey.com/product-detail/en/yageo/AC0805KKX8R9BB104/311-4624-1-ND/9699550; Device Package: 0805 (2012 Metric); LastUpdated: 02/09/2020 01:04:20; Lifecycle Status: Active; Minimum Order: 1; Mounting Type: Surface Mount, MLCC; Operating Temperature: -55°C ~ 150°C; Package / Case: 0805 (2012 Metric); Packaging: TapeAndReel; PartId: 14076; Part Status: Active; Price: 0.06; Ratings: AEC-Q200; Series: AC; Size / Dimension: 0.079" L x 0.049" W (2.00mm x 1.25mm); Supplier 1: DigiKey; Supplier Part Number 1: 311-4624-1-ND; Temperature Coefficient: X8R; Thickness (Max): 0.057" (1.45mm); Tolerance: ±10%; Voltage - Rated: 50V
D?#1 = STPS2L30A: DIODE SCHOTTKY 30V 2A SMA; Manufacturer: STMicroelectronics; Current - Reverse Leakage @ Vr: 200µA @ 30V; Speed: Fast Recovery =< 500ns, > 200mA (Io); Voltage - Forward (Vf) (Max) @ If: 450mV @ 2A; Part Number: STPS2L30A; ComponentLink1Description: Datasheet; ComponentLink1URL: http://www.st.com/content/ccc/resource/technical/document/datasheet/62/6b/2e/7f/34/cb/43/55/CD00001633.pdf/files/CD00001633.pdf/jcr:content/translations/en.CD00001633.pdf; ComponentLink2Description: DigiKey Link; ComponentLink2URL: http://digikey.com/product-detail/en/stmicroelectronics/STPS2L30A/497-3759-1-ND/691929; Current - Average Rectified (Io): 2A; Diode Type: Schottky; LastUpdated: 02/09/2020 01:19:04; Lifecycle Status: Active; Minimum Order: 1; Mounting Type: Surface Mount; Operating Temperature - Junction: 150°C (Max); Package / Case: DO-214AC, SMA; Packaging: TapeAndReel; PartId: 1916; Part Status: Active; Price: 0.07; Series: -; Supplier 1: DigiKey; Supplier Part Number 1: 497-3759-1-ND; Supplier Device Package: SMA; Voltage - DC Reverse (Vr) (Max): 30V
D?#2 = 5990240007F: LED YELLOW 1206 SMD; Manufacturer: Dialight; Configuration: Standard; Current - Test: 20mA; Lens Color: 0.80mm; Lens Size: 2.00mm x 1.60mm; Lens Style: Rectangle with Flat Top; Millicandela Rating: 126mcd; Viewing Angle: 140°; Voltage - Forward (Vf) (Typ): 2.1V; Wavelength - Dominant: 590nm; Part Number: 5990240007F; Color: Yellow; ComponentLink1Description: Datasheet; ComponentLink1URL: http://www.dialightsignalsandcomponents.com/Assets/Brochures_And_Catalogs/Indication/CBI_SMD_new/Dialight_CBI_data_599-1206_Apr2018.pdf; ComponentLink2Description: DigiKey Link; ComponentLink2URL: http://digikey.com/product-detail/en/dialight/5990240007F/350-4363-1-ND/9385469; Device Package: 1206 (3216 Metric); Height (Max): 0.80mm; LastUpdated: 02/09/2020 01:21:26; Lifecycle Status: Active; Minimum Order: 1; Mounting Type: Surface Mount; Package / Case: 1206 (3216 Metric); Packaging: TapeAndReel; PartId: 1; Part Status: Active; Price: 0.07; Series: 599; Size / Dimension: 3.20mm L x 1.60mm W; Supplier 1: DigiKey; Supplier Part Number 1: 350-4363-1-ND; Supplier Device Package: 1206; Value: Yellow
IC?#1 = LD1117S50TR: IC REG LINEAR 5V 800MA SOT223; Manufacturer: STMicroelectronics; Current - Quiescent (Iq): 10mA; Number of Regulators: 1; Output Configuration: Positive; Output Type: Fixed; Protection Features: Over Current, Over Temperature; PSRR: 75dB (120Hz); Voltage Dropout (Max): 1.2V @ 800mA; Voltage - Input (Max): 15V; Part Number: LD1117S50TR; ComponentLink1Description: Datasheet; ComponentLink1URL: http://www.st.com/content/ccc/resource/technical/document/datasheet/99/3b/7d/91/91/51/4b/be/CD00000544.pdf/files/CD00000544.pdf/jcr:content/translations/en.CD00000544.pdf; ComponentLink2Description: DigiKey Link; ComponentLink2URL: http://digikey.com/product-detail/en/stmicroelectronics/LD1117S50TR/497-6447-1-ND/1865475; Current - Output: 800mA; LastUpdated: 02/09/2020 01:24:39; Lifecycle Status: Active; Minimum Order: 1; Mounting Type: Surface Mount; Package / Case: TO-261-4, TO-261AA; Packaging: TapeAndReel; Part Status: Active; Price: 0.14; Series: -; Supplier 1: DigiKey; Supplier Part Number 1: 497-6447-1-ND; Supplier Device Package: SOT-223; Voltage - Output (Min/Fixed): 5V
IC?#2 = LT1965EMS8E-3.3#PBF: IC REG LINEAR 3.3V 1.1A 8MSOP; Manufacturer: Linear Technology/Analog Devices; Control Features: Enable; Current - Quiescent (Iq): 1.1mA; Current - Supply (Max): 40mA; Number of Regulators: 1; Output Configuration: Positive; Output Type: Fixed; Protection Features: Over Current, Over Temperature, Reverse Polarity; PSRR: 75dB (120Hz); Voltage Dropout (Max): 0.49V @ 1.1A; Voltage - Input (Max): 20V; Part Number: LT1965EMS8E-3.3#PBF; ComponentLink1Description: Datasheet; ComponentLink1URL: http://www.linear.com/docs/25320; ComponentLink2Description: DigiKey Link; ComponentLink2URL: http://digikey.com/product-detail/en/linear-technology-analog-devices/LT1965EMS8E-3.3-PBF/LT1965EMS8E-3.3-PBF-ND/2074395; Current - Output: 1.1A; LastUpdated: 02/09/2020 01:24:49; Lifecycle Status: Active; Minimum Order: 1; Mounting Type: Surface Mount; Operating Temperature: -40°C ~ 125°C; Package / Case: 8-TSSOP, 8-MSOP (0.118", 3.00mm Width) Exposed Pad; Packaging: Tube; Part Status: Active; Price: 4.83; Series: -; Supplier 1: DigiKey; Supplier Part Number 1: LT1965EMS8E-3.3#PBF-ND; Supplier Device Package: 8-MSOP-EP; Voltage - Output (Min/Fixed): 3.3V
R?#6 = RT0603FRE071KL: RES SMD 1K OHM 1% 1/10W 0603; Manufacturer: Yageo; Power (Watts): 0.1W, 1/10W; Temperature Coefficient: ±50ppm/°C; Part Number: RT0603FRE071KL; Value: 1 kOhms; ComponentLink1Description: Datasheet; ComponentLink1URL: https://www.yageo.com/upload/media/product/productsearch/datasheet/rchip/PYu-RT_1-to-0.01_RoHS_L_11.pdf; ComponentLink2Description: DigiKey Link; ComponentLink2URL: http://digikey.com/product-detail/en/yageo/RT0603FRE071KL/YAG2323CT-ND/5252437; Composition: Thin Film; Device Package: 0603 (1608 Metric); Height - Seated (Max): 0.022" (0.55mm); LastUpdated: 02/09/2020 01:10:23; Lifecycle Status: Active; Minimum Order: 1; Number of Terminations: 2; Operating Temperature: -55°C ~ 155°C; Package / Case: 0603 (1608 Metric); Packaging: TapeAndReel; PartId: 5672; Part Status: Active; Price: 0.01; Resistance: 1 kOhms; Series: RT; Size / Dimension: 0.063" L x 0.031" W (1.60mm x 0.80mm); Supplier 1: DigiKey; Supplier Part Number 1: YAG2323CT-ND; Supplier Device Package: 0603; Tolerance: ±1%

## Nets that join several sheets
GND: Debugger (38 pins), uC (20 pins), BaseBoard (10 pins), Power (10 pins)
PA3: Debugger (SB14.1), uC (C?#2.2 FB?.1 U.13 U.17), BaseBoard (D4.1)
VDD: uC (11 pins), Power (C?#15.1 C?#16.1 IC?#2.1 IC?#2.2)
NRST: Debugger (SB1.2), uC (C?#1.1 S?#1.3 S?#1.4 U.7)
PA0: uC (U.14), BaseBoard (D1.1)
PA1: uC (U.15), BaseBoard (D2.1)
PA2: Debugger (SB13.1), uC (U.16), BaseBoard (D3.1)
PA4: uC (U.20), BaseBoard (D5.1)
PA5: uC (U.21), BaseBoard (D6.1)
PA6: uC (U.22), BaseBoard (D7.1 D9.1)
PA7: uC (U.23), BaseBoard (D8.1 D10.1)
PA13: Debugger (SB9.1), uC (U.46)
PA14: Debugger (SB5.1), uC (U.49)
PB3: Debugger (SB2.2), uC (U.55)